# Altium project BOTTOM-REDUCED.PrjPcb
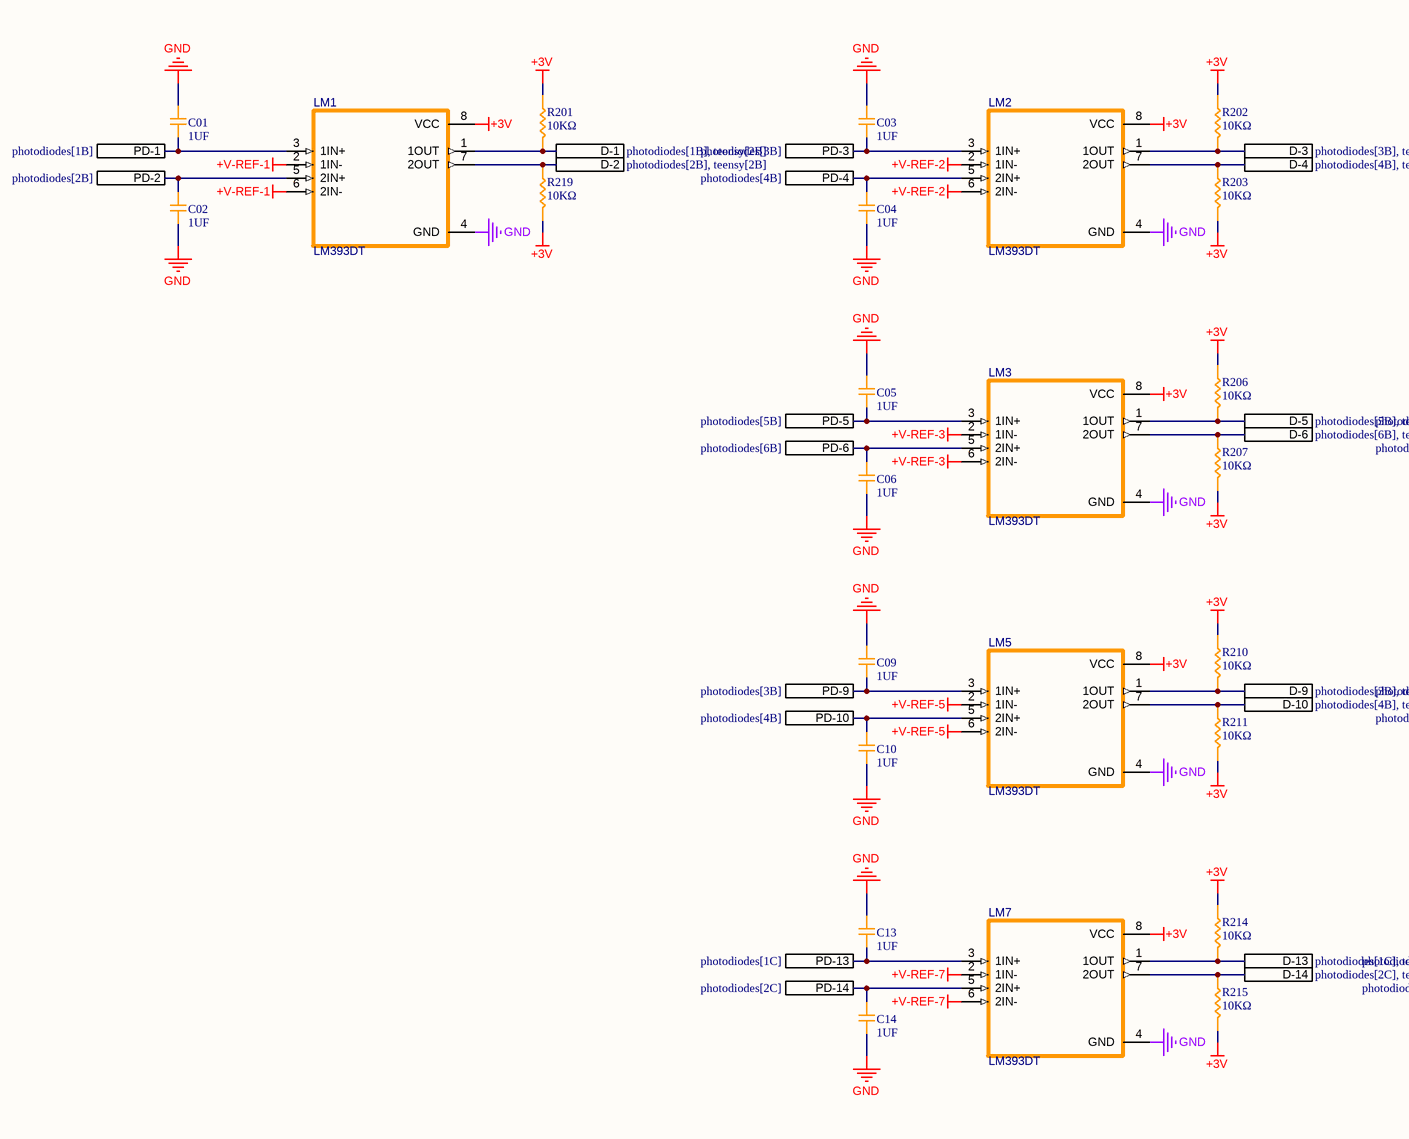
[diagram p0: comparators.SchDoc, left]
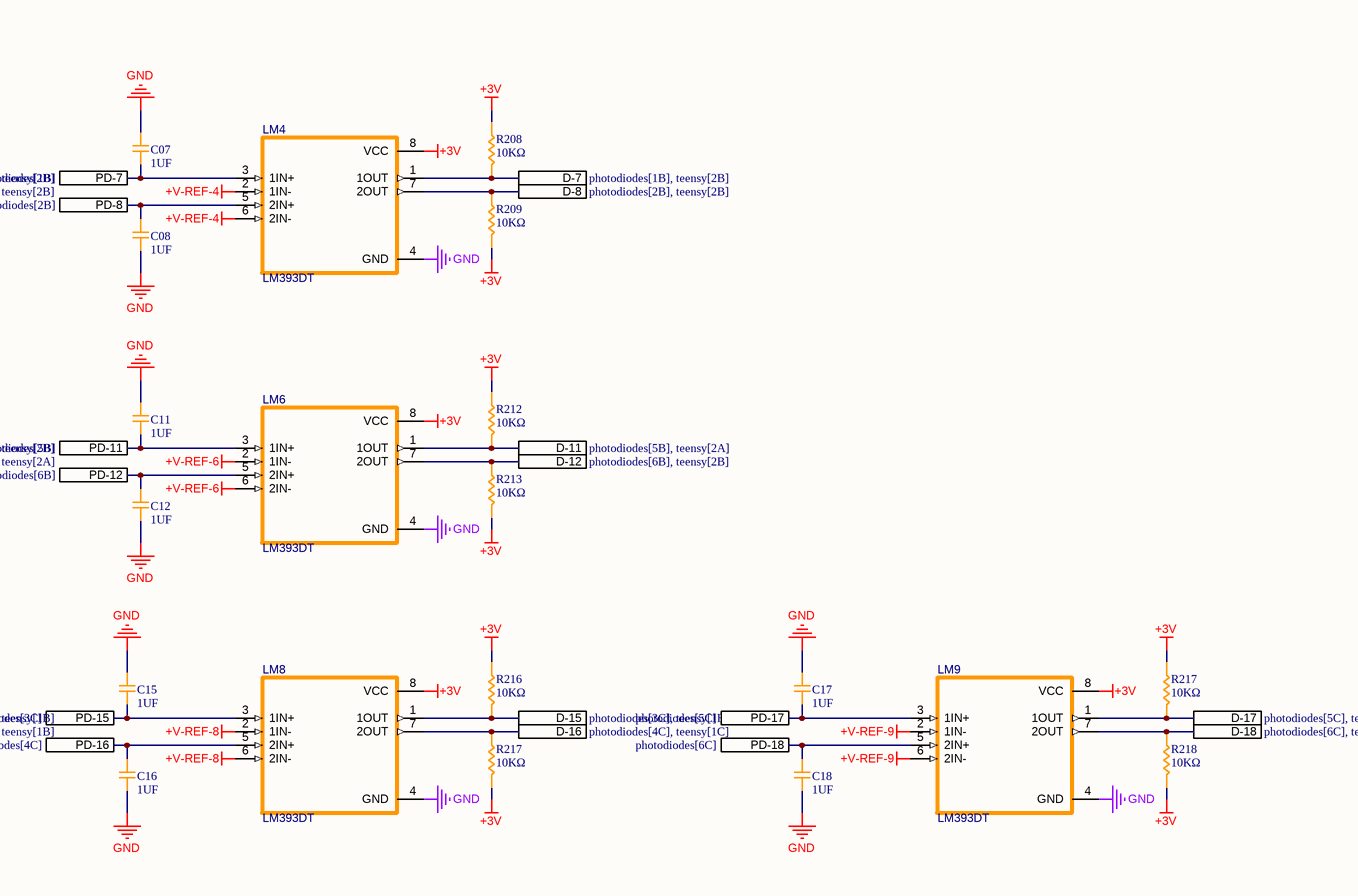
[diagram p1: comparators.SchDoc, right]
4 sheets, 137 parts. Net scope: flat (ports and power ports of the same name join across sheets).
Board file: BOTTOM-COMPARATOR.PcbDoc
Sheets:
  comparators.SchDoc
  neopixels.SchDoc
  photodiodes.SchDoc
  teensy.SchDoc

## Sheet comparators.SchDoc
size 508 x 241 mm; SheetNumber: 1; SheetTotal: 4

### Parts
(Parts that share a designator on the sheet are numbered #1, #2 ... from top to bottom, then left to right.)
C01  1UF  [CAP_0603]
C02  1UF  [CAP_0603]
C03  1UF  [CAP_0603]
C04  1UF  [CAP_0603]
C05  1UF  [CAP_0603]
C06  1UF  [CAP_0603]
C07  1UF  [CAP_0603]
C08  1UF  [CAP_0603]
C09  1UF  [CAP_0603]
C10  1UF  [CAP_0603]
C11  1UF  [CAP_0603]
C12  1UF  [CAP_0603]
C13  1UF  [CAP_0603]
C14  1UF  [CAP_0603]
C15  1UF  [CAP_0603]
C16  1UF  [CAP_0603]
C17  1UF  [CAP_0603]
C18  1UF  [CAP_0603]
LM1  LM393DT  [LM393DT]
LM2  LM393DT  [LM393DT]
LM3  LM393DT  [LM393DT]
LM4  LM393DT  [LM393DT]
LM5  LM393DT  [LM393DT]
LM6  LM393DT  [LM393DT]
LM7  LM393DT  [LM393DT]
LM8  LM393DT  [LM393DT]
LM9  LM393DT  [LM393DT]
R201  10KΩ  [RES_0603]
R202  10KΩ  [RES_0603]
R203  10KΩ  [RES_0603]
R206  10KΩ  [RES_0603]
R207  10KΩ  [RES_0603]
R208  10KΩ  [RES_0603]
R209  10KΩ  [RES_0603]
R210  10KΩ  [RES_0603]
R211  10KΩ  [RES_0603]
R212  10KΩ  [RES_0603]
R213  10KΩ  [RES_0603]
R214  10KΩ  [RES_0603]
R215  10KΩ  [RES_0603]
R216  10KΩ  [RES_0603]
R217#1  10KΩ  [RES_0603]
R217#2  10KΩ  [RES_0603]
R218  10KΩ  [RES_0603]
R219  10KΩ  [RES_0603]

### Ports
D-1 (see photodiodes[1B], teensy[2B]), D-2 (see photodiodes[2B], teensy[2B]), D-3 (see photodiodes[3B], teensy[2B]), D-4 (see photodiodes[4B], teensy[2B]), D-5 (see photodiodes[5B], teensy[2B]), D-6 (see photodiodes[6B], teensy[2B]), D-7 (see photodiodes[1B], teensy[2B]), D-8 (see photodiodes[2B], teensy[2B]), D-9 (see photodiodes[3B], teensy[2B]), D-10 (see photodiodes[4B], teensy[2A]), D-11 (see photodiodes[5B], teensy[2A]), D-12 (see photodiodes[6B], teensy[2B]), D-13 (see photodiodes[1C], teensy[1B]), D-14 (see photodiodes[2C], teensy[1B]), D-15 (see photodiodes[3C], teensy[1B]), D-16 (see photodiodes[4C], teensy[1C]), D-17 (see photodiodes[5C], teensy[2B]), D-18 (see photodiodes[6C], teensy[2C]), PD-1 (see photodiodes[1B]), PD-2 (see photodiodes[2B]), PD-3 (see photodiodes[3B]), PD-4 (see photodiodes[4B]), PD-5 (see photodiodes[5B]), PD-6 (see photodiodes[6B]), PD-7 (see photodiodes[1B]), PD-8 (see photodiodes[2B]), PD-9 (see photodiodes[3B]), PD-10 (see photodiodes[4B]), PD-11 (see photodiodes[5B]), PD-12 (see photodiodes[6B]), PD-13 (see photodiodes[1C]), PD-14 (see photodiodes[2C]), PD-15 (see photodiodes[3C]), PD-16 (see photodiodes[4C]), PD-17 (see photodiodes[5C]), PD-18 (see photodiodes[6C])

### Nets
+3V: LM1.8(VCC) LM2.8(VCC) LM3.8(VCC) LM4.8(VCC) LM5.8(VCC) LM6.8(VCC) LM7.8(VCC) LM8.8(VCC) LM9.8(VCC) R201.2 R202.2 R203.1 R206.2 R207.1 R208.2 R209.1 R210.2 R211.1 R212.2 R213.1 R214.2 R215.1 R216.2 R217#1.2 R217#2.1 R218.1 R219.1
+V-REF-1: LM1.2(1IN-) LM1.6(2IN-)
+V-REF-2: LM2.2(1IN-) LM2.6(2IN-)
+V-REF-3: LM3.2(1IN-) LM3.6(2IN-)
+V-REF-4: LM4.2(1IN-) LM4.6(2IN-)
+V-REF-5: LM5.2(1IN-) LM5.6(2IN-)
+V-REF-6: LM6.2(1IN-) LM6.6(2IN-)
+V-REF-7: LM7.2(1IN-) LM7.6(2IN-)
+V-REF-8: LM8.2(1IN-) LM8.6(2IN-)
+V-REF-9: LM9.2(1IN-) LM9.6(2IN-)
GND: C01.1 C02.2 C03.1 C04.1 C05.1 C06.2 C07.1 C08.2 C09.1 C10.2 C11.1 C12.2 C13.1 C14.2 C15.1 C16.2 C17.1 C18.2 LM1.4(GND) LM2.4(GND) LM3.4(GND) LM4.4(GND) LM5.4(GND) LM6.4(GND) LM7.4(GND) LM8.4(GND) LM9.4(GND)
NetC01_2: C01.2 LM1.3(1IN+) ; port PD-1
NetC02_1: C02.1 LM1.5(2IN+) ; port PD-2
NetC03_2: C03.2 LM2.3(1IN+) ; port PD-3
NetC04_2: C04.2 LM2.5(2IN+) ; port PD-4
NetC05_2: C05.2 LM3.3(1IN+) ; port PD-5
NetC06_1: C06.1 LM3.5(2IN+) ; port PD-6
NetC07_2: C07.2 LM4.3(1IN+) ; port PD-7
NetC08_1: C08.1 LM4.5(2IN+) ; port PD-8
NetC09_2: C09.2 LM5.3(1IN+) ; port PD-9
NetC10_1: C10.1 LM5.5(2IN+) ; port PD-10
NetC11_2: C11.2 LM6.3(1IN+) ; port PD-11
NetC12_1: C12.1 LM6.5(2IN+) ; port PD-12
NetC13_2: C13.2 LM7.3(1IN+) ; port PD-13
NetC14_1: C14.1 LM7.5(2IN+) ; port PD-14
NetC15_2: C15.2 LM8.3(1IN+) ; port PD-15
NetC16_1: C16.1 LM8.5(2IN+) ; port PD-16
NetC17_2: C17.2 LM9.3(1IN+) ; port PD-17
NetC18_1: C18.1 LM9.5(2IN+) ; port PD-18
NetLM1_1: LM1.1(1OUT) R201.1 ; port D-1
NetLM1_7: LM1.7(2OUT) R219.2 ; port D-2
NetLM2_1: LM2.1(1OUT) R202.1 ; port D-3
NetLM2_7: LM2.7(2OUT) R203.2 ; port D-4
NetLM3_1: LM3.1(1OUT) R206.1 ; port D-5
NetLM3_7: LM3.7(2OUT) R207.2 ; port D-6
NetLM4_1: LM4.1(1OUT) R208.1 ; port D-7
NetLM4_7: LM4.7(2OUT) R209.2 ; port D-8
NetLM5_1: LM5.1(1OUT) R210.1 ; port D-9
NetLM5_7: LM5.7(2OUT) R211.2 ; port D-10
NetLM6_1: LM6.1(1OUT) R212.1 ; port D-11
NetLM6_7: LM6.7(2OUT) R213.2 ; port D-12
NetLM7_1: LM7.1(1OUT) R214.1 ; port D-13
NetLM7_7: LM7.7(2OUT) R215.2 ; port D-14
NetLM8_1: LM8.1(1OUT) R216.1 ; port D-15
NetLM8_7: LM8.7(2OUT) R217#2.2 ; port D-16
NetLM9_1: LM9.1(1OUT) R217#1.1 ; port D-17
NetLM9_7: LM9.7(2OUT) R218.2 ; port D-18

### Library data of the parts
C01 C02 C03 C04 C05 C06 C07 C08 C09-C18 = CAP_0603: Capacitor SMD 0603 generic
R201-R203 R206-R216 R217#1 R217#2 R218 R219 = RES_0603: Resistor SMD 0603 generic

## Sheet neopixels.SchDoc
size 558 x 203 mm; SheetNumber: 2; SheetTotal: 3
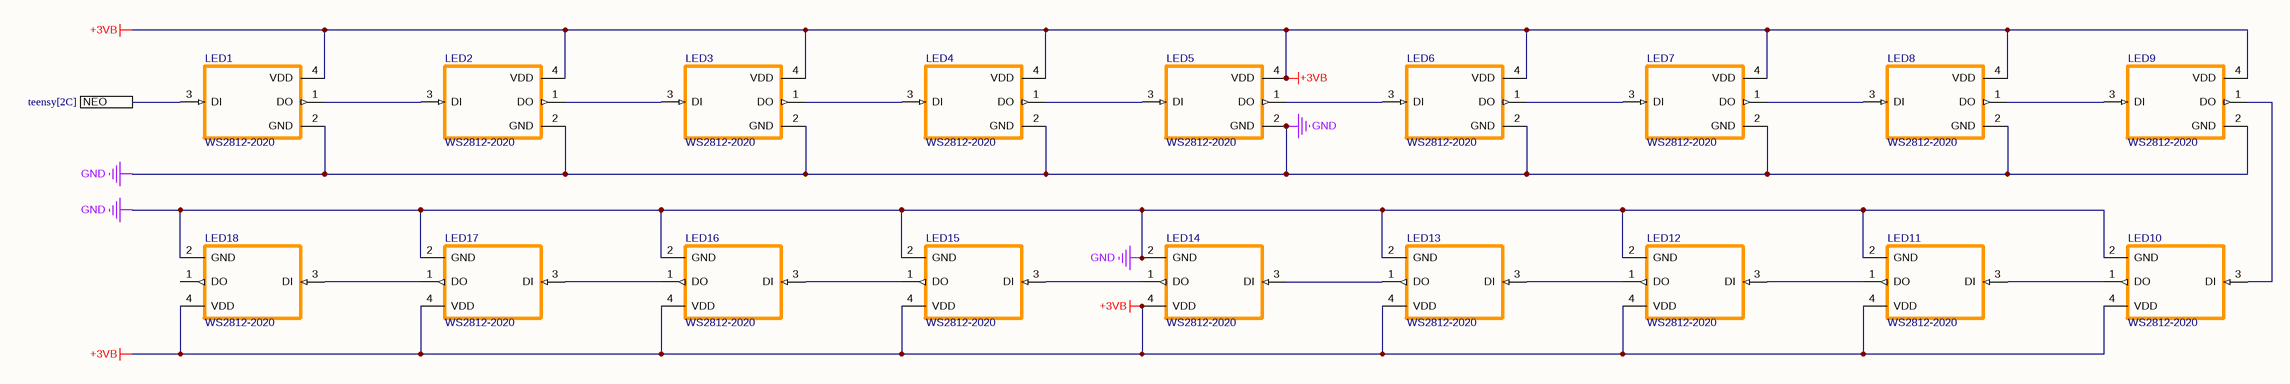
[diagram p2: neopixels.SchDoc]

### Parts
LED1  WS2812-2020  [WS2812-2020]
LED2  WS2812-2020  [WS2812-2020]
LED3  WS2812-2020  [WS2812-2020]
LED4  WS2812-2020  [WS2812-2020]
LED5  WS2812-2020  [WS2812-2020]
LED6  WS2812-2020  [WS2812-2020]
LED7  WS2812-2020  [WS2812-2020]
LED8  WS2812-2020  [WS2812-2020]
LED9  WS2812-2020  [WS2812-2020]
LED10  WS2812-2020  [WS2812-2020]
LED11  WS2812-2020  [WS2812-2020]
LED12  WS2812-2020  [WS2812-2020]
LED13  WS2812-2020  [WS2812-2020]
LED14  WS2812-2020  [WS2812-2020]
LED15  WS2812-2020  [WS2812-2020]
LED16  WS2812-2020  [WS2812-2020]
LED17  WS2812-2020  [WS2812-2020]
LED18  WS2812-2020  [WS2812-2020]

### Ports
NEO (see teensy[2C])

### Nets
+3VB: LED1.4(VDD) LED2.4(VDD) LED3.4(VDD) LED4.4(VDD) LED5.4(VDD) LED6.4(VDD) LED7.4(VDD) LED8.4(VDD) LED9.4(VDD) LED10.4(VDD) LED11.4(VDD) LED12.4(VDD) LED13.4(VDD) LED14.4(VDD) LED15.4(VDD) LED16.4(VDD) LED17.4(VDD) LED18.4(VDD)
GND: LED1.2(GND) LED2.2(GND) LED3.2(GND) LED4.2(GND) LED5.2(GND) LED6.2(GND) LED7.2(GND) LED8.2(GND) LED9.2(GND) LED10.2(GND) LED11.2(GND) LED12.2(GND) LED13.2(GND) LED14.2(GND) LED15.2(GND) LED16.2(GND) LED17.2(GND) LED18.2(GND)
NetLED1_1: LED1.1(DO) LED2.3(DI)
NetLED1_3: LED1.3(DI) ; port NEO
NetLED2_1: LED2.1(DO) LED3.3(DI)
NetLED3_1: LED3.1(DO) LED4.3(DI)
NetLED4_1: LED4.1(DO) LED5.3(DI)
NetLED5_1: LED5.1(DO) LED6.3(DI)
NetLED6_1: LED6.1(DO) LED7.3(DI)
NetLED7_1: LED7.1(DO) LED8.3(DI)
NetLED8_1: LED8.1(DO) LED9.3(DI)
NetLED9_1: LED9.1(DO) LED10.3(DI)
NetLED10_1: LED10.1(DO) LED11.3(DI)
NetLED11_1: LED11.1(DO) LED12.3(DI)
NetLED12_1: LED12.1(DO) LED13.3(DI)
NetLED13_1: LED13.1(DO) LED14.3(DI)
NetLED14_1: LED14.1(DO) LED15.3(DI)
NetLED15_1: LED15.1(DO) LED16.3(DI)
NetLED16_1: LED16.1(DO) LED17.3(DI)
NetLED17_1: LED17.1(DO) LED18.3(DI)

Not connected (* = marked no-connect by the designer): LED18 1(DO)

## Sheet photodiodes.SchDoc
size 457 x 241 mm; SheetNumber: 3; SheetTotal: 4
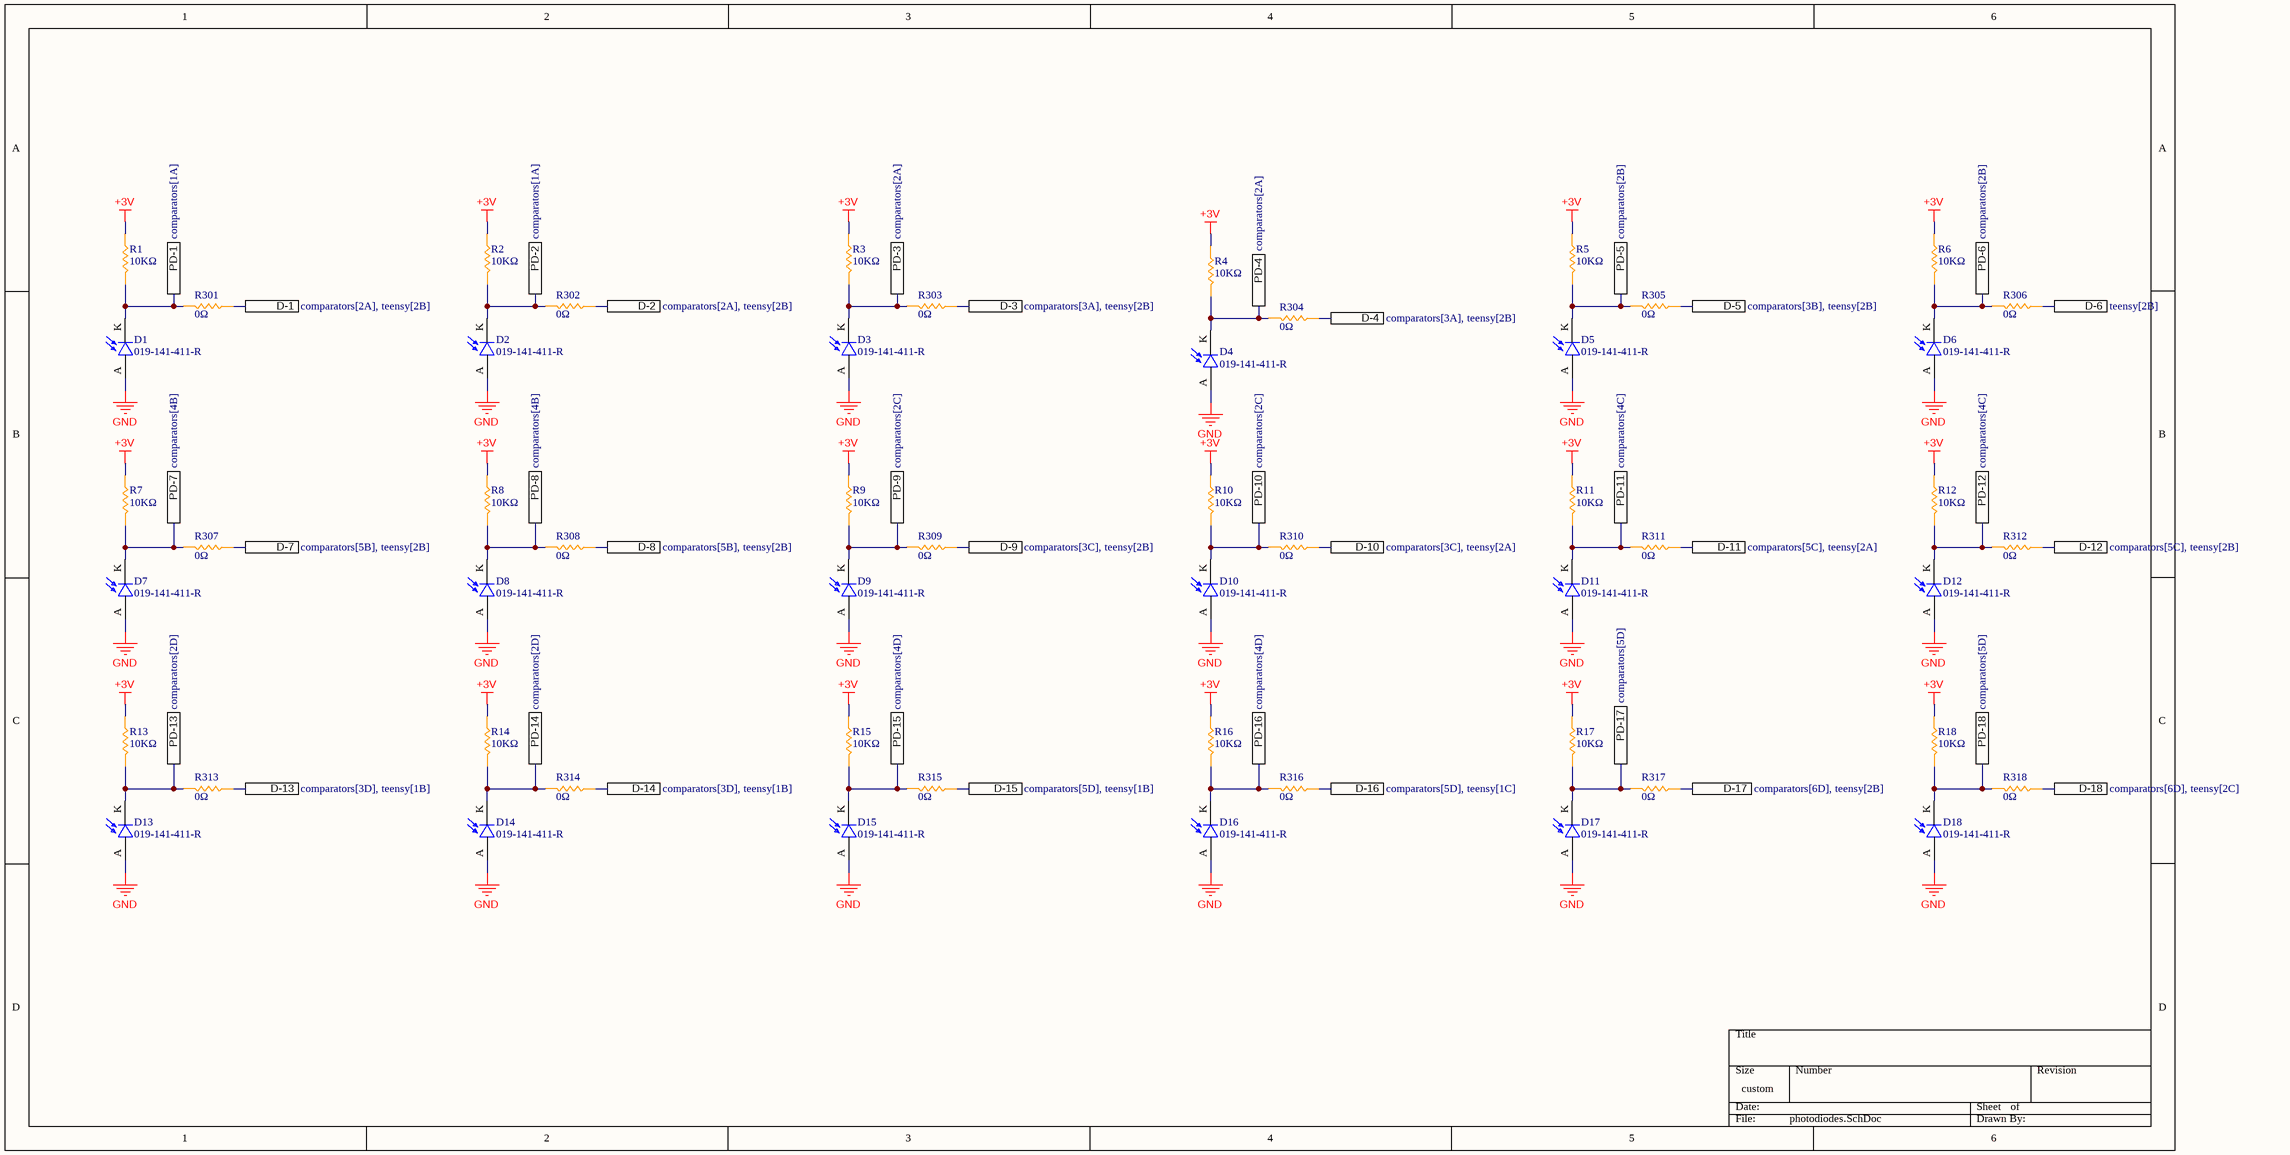
[diagram p3: photodiodes.SchDoc]

### Parts
D1  019-141-411-R  [DIOC2012X80N]
D2  019-141-411-R  [DIOC2012X80N]
D3  019-141-411-R  [DIOC2012X80N]
D4  019-141-411-R  [DIOC2012X80N]
D5  019-141-411-R  [DIOC2012X80N]
D6  019-141-411-R  [DIOC2012X80N]
D7  019-141-411-R  [DIOC2012X80N]
D8  019-141-411-R  [DIOC2012X80N]
D9  019-141-411-R  [DIOC2012X80N]
D10  019-141-411-R  [DIOC2012X80N]
D11  019-141-411-R  [DIOC2012X80N]
D12  019-141-411-R  [DIOC2012X80N]
D13  019-141-411-R  [DIOC2012X80N]
D14  019-141-411-R  [DIOC2012X80N]
D15  019-141-411-R  [DIOC2012X80N]
D16  019-141-411-R  [DIOC2012X80N]
D17  019-141-411-R  [DIOC2012X80N]
D18  019-141-411-R  [DIOC2012X80N]
R1  10KΩ  [RES_0603]
R2  10KΩ  [RES_0603]
R3  10KΩ  [RES_0603]
R4  10KΩ  [RES_0603]
R5  10KΩ  [RES_0603]
R6  10KΩ  [RES_0603]
R7  10KΩ  [RES_0603]
R8  10KΩ  [RES_0603]
R9  10KΩ  [RES_0603]
R10  10KΩ  [RES_0603]
R11  10KΩ  [RES_0603]
R12  10KΩ  [RES_0603]
R13  10KΩ  [RES_0603]
R14  10KΩ  [RES_0603]
R15  10KΩ  [RES_0603]
R16  10KΩ  [RES_0603]
R17  10KΩ  [RES_0603]
R18  10KΩ  [RES_0603]
R301  0Ω  [RES_0603]
R302  0Ω  [RES_0603]
R303  0Ω  [RES_0603]
R304  0Ω  [RES_0603]
R305  0Ω  [RES_0603]
R306  0Ω  [RES_0603]
R307  0Ω  [RES_0603]
R308  0Ω  [RES_0603]
R309  0Ω  [RES_0603]
R310  0Ω  [RES_0603]
R311  0Ω  [RES_0603]
R312  0Ω  [RES_0603]
R313  0Ω  [RES_0603]
R314  0Ω  [RES_0603]
R315  0Ω  [RES_0603]
R316  0Ω  [RES_0603]
R317  0Ω  [RES_0603]
R318  0Ω  [RES_0603]

### Ports
D-1 (see comparators[2A], teensy[2B]), D-2 (see comparators[2A], teensy[2B]), D-3 (see comparators[3A], teensy[2B]), D-4 (see comparators[3A], teensy[2B]), D-5 (see comparators[3B], teensy[2B]), D-6 (see teensy[2B]), D-7 (see comparators[5B], teensy[2B]), D-8 (see comparators[5B], teensy[2B]), D-9 (see comparators[3C], teensy[2B]), D-10 (see comparators[3C], teensy[2A]), D-11 (see comparators[5C], teensy[2A]), D-12 (see comparators[5C], teensy[2B]), D-13 (see comparators[3D], teensy[1B]), D-14 (see comparators[3D], teensy[1B]), D-15 (see comparators[5D], teensy[1B]), D-16 (see comparators[5D], teensy[1C]), D-17 (see comparators[6D], teensy[2B]), D-18 (see comparators[6D], teensy[2C]), PD-1 (see comparators[1A]), PD-2 (see comparators[1A]), PD-3 (see comparators[2A]), PD-4 (see comparators[2A]), PD-5 (see comparators[2B]), PD-6 (see comparators[2B]), PD-7 (see comparators[4B]), PD-8 (see comparators[4B]), PD-9 (see comparators[2C]), PD-10 (see comparators[2C]), PD-11 (see comparators[4C]), PD-12 (see comparators[4C]), PD-13 (see comparators[2D]), PD-14 (see comparators[2D]), PD-15 (see comparators[4D]), PD-16 (see comparators[4D]), PD-17 (see comparators[5D]), PD-18 (see comparators[5D])

### Nets
+3V: R1.2 R2.2 R3.2 R4.2 R5.2 R6.2 R7.2 R8.2 R9.2 R10.2 R11.2 R12.2 R13.2 R14.2 R15.2 R16.2 R17.2 R18.2
GND: D1.A D2.A D3.A D4.A D5.A D6.A D7.A D8.A D9.A D10.A D11.A D12.A D13.A D14.A D15.A D16.A D17.A D18.A
NetC01_2: D1.K(C) R1.1 R301.1 ; port PD-1
NetC02_1: D2.K(C) R2.1 R302.1 ; port PD-2
NetC03_2: D3.K(C) R3.1 R303.1 ; port PD-3
NetC04_2: D4.K(C) R4.1 R304.1 ; port PD-4
NetC05_2: D5.K(C) R5.1 R305.1 ; port PD-5
NetC06_1: D6.K(C) R6.1 R306.1 ; port PD-6
NetC07_2: D7.K(C) R7.1 R307.1 ; port PD-7
NetC08_1: D8.K(C) R8.1 R308.1 ; port PD-8
NetC09_2: D9.K(C) R9.1 R309.1 ; port PD-9
NetC10_1: D10.K(C) R10.1 R310.1 ; port PD-10
NetC11_2: D11.K(C) R11.1 R311.1 ; port PD-11
NetC12_1: D12.K(C) R12.1 R312.1 ; port PD-12
NetC13_2: D13.K(C) R13.1 R313.1 ; port PD-13
NetC14_1: D14.K(C) R14.1 R314.1 ; port PD-14
NetC15_2: D15.K(C) R15.1 R315.1 ; port PD-15
NetC16_1: D16.K(C) R16.1 R316.1 ; port PD-16
NetC17_2: D17.K(C) R17.1 R317.1 ; port PD-17
NetC18_1: D18.K(C) R18.1 R318.1 ; port PD-18
NetLM1_1: R301.2 ; port D-1
NetLM1_7: R302.2 ; port D-2
NetLM2_1: R303.2 ; port D-3
NetLM2_7: R304.2 ; port D-4
NetLM3_1: R305.2 ; port D-5
NetLM3_7: R306.2 ; port D-6
NetLM4_1: R307.2 ; port D-7
NetLM4_7: R308.2 ; port D-8
NetLM5_1: R309.2 ; port D-9
NetLM5_7: R310.2 ; port D-10
NetLM6_1: R311.2 ; port D-11
NetLM6_7: R312.2 ; port D-12
NetLM7_1: R313.2 ; port D-13
NetLM7_7: R314.2 ; port D-14
NetLM8_1: R315.2 ; port D-15
NetLM8_7: R316.2 ; port D-16
NetLM9_1: R317.2 ; port D-17
NetLM9_7: R318.2 ; port D-18

### Library data of the parts
D1-D18 = 019-141-411-R: PHOTODIODE RED MICRO SMT; MF: Advanced Photonix; Price: None; Check_prices: https://www.snapeda.com/parts/019-141-411-R/Advanced%20Photonix/view-part/5167997/?ref=eda; Value: *; Purchase-URL: https://pricing.snapeda.com/search/part/019-141-411-R/?ref=eda; Package: None; SnapEDA_Link: https://www.snapeda.com/parts/019-141-411-R/Advanced%20Photonix/view-part/5167997/?ref=snap; MP: 019-141-411-R; Availability: Warning
R1-R18 R301-R318 = RES_0603: Resistor SMD 0603 generic

## Sheet teensy.SchDoc
size A; SheetNumber: 4; SheetTotal: 4
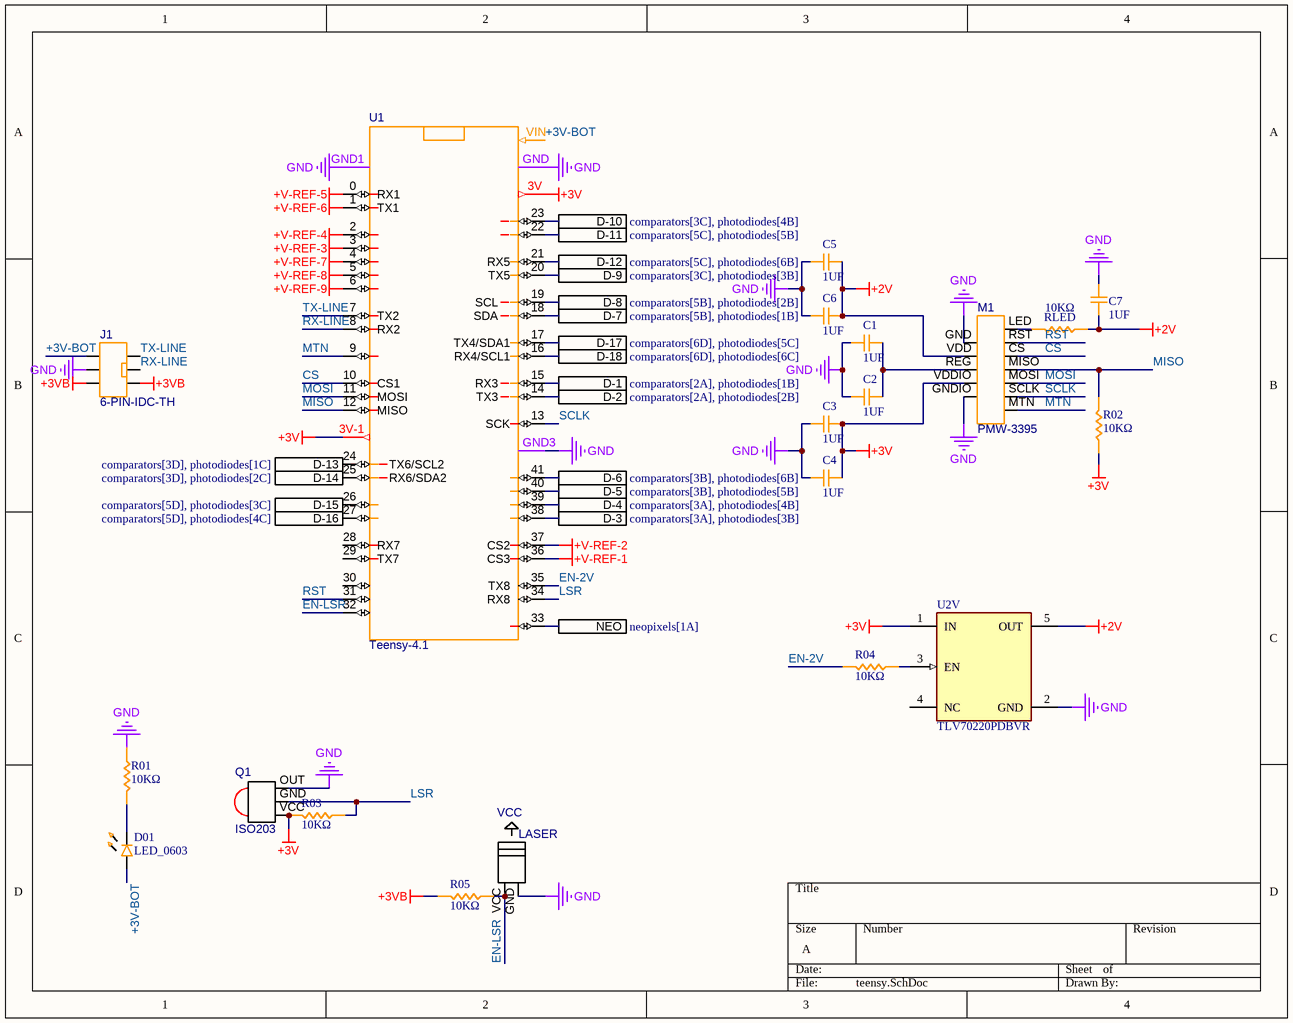
[diagram p4: teensy.SchDoc]

### Parts
C1  1UF  [CAP_0603]
C2  1UF  [CAP_0603]
C3  1UF  [CAP_0603]
C4  1UF  [CAP_0603]
C5  1UF  [CAP_0603]
C6  1UF  [CAP_0603]
C7  1UF  [CAP_0603]
D01  LED_0603  [LED_0603]
J1  6-PIN-IDC-TH  [6-PIN-IDC-TH]
M1  PMW-3395  [MOUSE-DIP16]
Q1  ISO203  [TSSP-58038]
R01  10KΩ  [RES_0603]
R02  10KΩ  [RES_0603]
R03  10KΩ  [RES_0603]
R04  10KΩ  [RES_0603]
R05  10KΩ  [RES_0603]
RLED  10KΩ  [RES_0603]
U1  Teensy-4.1  [Teensy-4.1]
U2V  TLV70220PDBVR  [FP-DBV0005A-MFG]
VCC  LASER  [LASER]

### Ports
D-1 (see comparators[2A], photodiodes[1B]), D-2 (see comparators[2A], photodiodes[2B]), D-3 (see comparators[3A], photodiodes[3B]), D-4 (see comparators[3A], photodiodes[4B]), D-5 (see comparators[3B], photodiodes[5B]), D-6 (see comparators[3B], photodiodes[6B]), D-7 (see comparators[5B], photodiodes[1B]), D-8 (see comparators[5B], photodiodes[2B]), D-9 (see comparators[3C], photodiodes[3B]), D-10 (see comparators[3C], photodiodes[4B]), D-11 (see comparators[5C], photodiodes[5B]), D-12 (see comparators[5C], photodiodes[6B]), D-13 (see comparators[3D], photodiodes[1C]), D-14 (see comparators[3D], photodiodes[2C]), D-15 (see comparators[5D], photodiodes[3C]), D-16 (see comparators[5D], photodiodes[4C]), D-17 (see comparators[6D], photodiodes[5C]), D-18 (see comparators[6D], photodiodes[6C]), NEO (see neopixels[1A])

### Nets
+2V: C5.1 C6.1 C7.1 M1.VDD RLED.2 U2V.5(OUT)
+3V: C3.2 C4.2 M1.VDDIO Q1.VCC R02.2 R03.1 U1.3V U1.3V-1 U2V.1(IN)
+3VB: J1.3 J1.4 R05.1
+V-REF-1: U1.36(CS3)
+V-REF-2: U1.37(CS2)
+V-REF-3: U1.3
+V-REF-4: U1.2
+V-REF-5: U1.0(RX1)
+V-REF-6: U1.1(TX1)
+V-REF-7: U1.4
+V-REF-8: U1.5
+V-REF-9: U1.6
GND: C1.1 C2.1 C3.1 C4.1 C5.2 C6.2 C7.2 J1.2 M1.GND M1.GNDIO Q1.OUT R01.2 U1.GND U1.GND1 U1.GND3 U2V.2(GND) VCC.GND
+3V-BOT: D01.A J1.1 U1.VIN
CS: M1.CS U1.10(CS1)
EN-2V: R04.1 U1.35(TX8)
EN-LSR: R05.2 U1.32 VCC.VCC
LSR: Q1.GND R03.2 U1.34(RX8)
MISO: M1.MISO R02.1 U1.12(MISO)
MOSI: M1.MOSI U1.11(MOSI)
MTN: M1.MTN U1.9
RST: M1.RST U1.31
RX-LINE: J1.5 U1.8(RX2)
SCLK: M1.SCLK U1.13(SCK)
TX-LINE: J1.6 U1.7(TX2)
NetC1_2: C1.2 C2.2 M1.REG
NetD01_C: D01.C R01.1
NetLED1_3: U1.33 ; port NEO
NetLM1_1: U1.15(RX3) ; port D-1
NetLM1_7: U1.14(TX3) ; port D-2
NetLM2_1: U1.38 ; port D-3
NetLM2_7: U1.39 ; port D-4
NetLM3_1: U1.40 ; port D-5
NetLM3_7: U1.41 ; port D-6
NetLM4_1: U1.18(SDA) ; port D-7
NetLM4_7: U1.19(SCL) ; port D-8
NetLM5_1: U1.20(TX5) ; port D-9
NetLM5_7: U1.23 ; port D-10
NetLM6_1: U1.22 ; port D-11
NetLM6_7: U1.21(RX5) ; port D-12
NetLM7_1: U1.24(TX6/SCL2) ; port D-13
NetLM7_7: U1.25(RX6/SDA2) ; port D-14
NetLM8_1: U1.26 ; port D-15
NetLM8_7: U1.27 ; port D-16
NetLM9_1: U1.17(TX4/SDA1) ; port D-17
NetLM9_7: U1.16(RX4/SCL1) ; port D-18
NetM1_LED: M1.LED RLED.1
NetR04_2: R04.2 U2V.3(EN)

Not connected (* = marked no-connect by the designer): U1 28(RX7) 29(TX7) 30; U2V 4(NC)

### Library data of the parts
C1-C7 = CAP_0603: Capacitor SMD 0603 generic
Q1 = TSSP-58038
R01 R02 R03 R04 R05 RLED = RES_0603: Resistor SMD 0603 generic
U2V = CMP-0394-00506-3: IC REG LINEAR 2V 300MA SOT23-5; Manufacturer: Texas Instruments; Number Of Outputs: 1; Max Junction Temp: +125°C; Max Supply Voltage: 5.5V; Ciiva Ids: 1503676; Standoff Height: 0mm; Dropout Voltage: 260mV; Output Type: Fixed; Accuracy Percentage: 0.5%; Import Ts: 1521850062; Output Voltage: 2V; Temperature Range High: +125°C; Lead Free: Yes; Digikey Description: IC REG LINEAR 2V 300MA SOT23-5; Release Date: 1464578725; Manufacturer Part Number: TLV70220PDBVR; Category: IC; Octopart: https://octopart.com/tlv70220pdbvr-texas+instruments-20023687; RoHS: TRUE; Automotive: No; Output Current: 300mA; ComponentLink2Description: Datasheet; Device Class L3: Voltage Regulators - Linear; ComponentLink2URL: http://www.ti.com/lit/ds/symlink/tlv702p.pdf; Mouser Description: LDO Voltage Regulators 300mA,Low IQ,LDO Reg; Package: DBV0005A; Height: 1.45mm; Min Supply Voltage: 2V; Device Class L2: Power Management ICs; Device Class L1: Integrated Circuits (ICs); Temperature: -40°C to +125°C; Temperature Range Low: -40°C

## Nets that join several sheets
+3V: comparators (27 pins), photodiodes (18 pins), teensy (9 pins)
+3VB: neopixels (18 pins), teensy (J1.3 J1.4 R05.1)
+V-REF-1: comparators (LM1.2 LM1.6), teensy (U1.36)
+V-REF-2: comparators (LM2.2 LM2.6), teensy (U1.37)
+V-REF-3: comparators (LM3.2 LM3.6), teensy (U1.3)
+V-REF-4: comparators (LM4.2 LM4.6), teensy (U1.2)
+V-REF-5: comparators (LM5.2 LM5.6), teensy (U1.0)
+V-REF-6: comparators (LM6.2 LM6.6), teensy (U1.1)
+V-REF-7: comparators (LM7.2 LM7.6), teensy (U1.4)
+V-REF-8: comparators (LM8.2 LM8.6), teensy (U1.5)
+V-REF-9: comparators (LM9.2 LM9.6), teensy (U1.6)
GND: comparators (27 pins), neopixels (18 pins), photodiodes (18 pins), teensy (17 pins)
NetC01_2: comparators (C01.2 LM1.3), photodiodes (D1.K R1.1 R301.1)
NetC02_1: comparators (C02.1 LM1.5), photodiodes (D2.K R2.1 R302.1)
NetC03_2: comparators (C03.2 LM2.3), photodiodes (D3.K R3.1 R303.1)
NetC04_2: comparators (C04.2 LM2.5), photodiodes (D4.K R4.1 R304.1)
NetC05_2: comparators (C05.2 LM3.3), photodiodes (D5.K R5.1 R305.1)
NetC06_1: comparators (C06.1 LM3.5), photodiodes (D6.K R6.1 R306.1)
NetC07_2: comparators (C07.2 LM4.3), photodiodes (D7.K R7.1 R307.1)
NetC08_1: comparators (C08.1 LM4.5), photodiodes (D8.K R8.1 R308.1)
NetC09_2: comparators (C09.2 LM5.3), photodiodes (D9.K R9.1 R309.1)
NetC10_1: comparators (C10.1 LM5.5), photodiodes (D10.K R10.1 R310.1)
NetC11_2: comparators (C11.2 LM6.3), photodiodes (D11.K R11.1 R311.1)
NetC12_1: comparators (C12.1 LM6.5), photodiodes (D12.K R12.1 R312.1)
NetC13_2: comparators (C13.2 LM7.3), photodiodes (D13.K R13.1 R313.1)
NetC14_1: comparators (C14.1 LM7.5), photodiodes (D14.K R14.1 R314.1)
NetC15_2: comparators (C15.2 LM8.3), photodiodes (D15.K R15.1 R315.1)
NetC16_1: comparators (C16.1 LM8.5), photodiodes (D16.K R16.1 R316.1)
NetC17_2: comparators (C17.2 LM9.3), photodiodes (D17.K R17.1 R317.1)
NetC18_1: comparators (C18.1 LM9.5), photodiodes (D18.K R18.1 R318.1)
NetLED1_3: neopixels (LED1.3), teensy (U1.33)
NetLM1_1: comparators (LM1.1 R201.1), photodiodes (R301.2), teensy (U1.15)
NetLM1_7: comparators (LM1.7 R219.2), photodiodes (R302.2), teensy (U1.14)
NetLM2_1: comparators (LM2.1 R202.1), photodiodes (R303.2), teensy (U1.38)
NetLM2_7: comparators (LM2.7 R203.2), photodiodes (R304.2), teensy (U1.39)
NetLM3_1: comparators (LM3.1 R206.1), photodiodes (R305.2), teensy (U1.40)
NetLM3_7: comparators (LM3.7 R207.2), photodiodes (R306.2), teensy (U1.41)
NetLM4_1: comparators (LM4.1 R208.1), photodiodes (R307.2), teensy (U1.18)
NetLM4_7: comparators (LM4.7 R209.2), photodiodes (R308.2), teensy (U1.19)
NetLM5_1: comparators (LM5.1 R210.1), photodiodes (R309.2), teensy (U1.20)
NetLM5_7: comparators (LM5.7 R211.2), photodiodes (R310.2), teensy (U1.23)
NetLM6_1: comparators (LM6.1 R212.1), photodiodes (R311.2), teensy (U1.22)
NetLM6_7: comparators (LM6.7 R213.2), photodiodes (R312.2), teensy (U1.21)
NetLM7_1: comparators (LM7.1 R214.1), photodiodes (R313.2), teensy (U1.24)
NetLM7_7: comparators (LM7.7 R215.2), photodiodes (R314.2), teensy (U1.25)
NetLM8_1: comparators (LM8.1 R216.1), photodiodes (R315.2), teensy (U1.26)
NetLM8_7: comparators (LM8.7 R217#2.2), photodiodes (R316.2), teensy (U1.27)
NetLM9_1: comparators (LM9.1 R217#1.1), photodiodes (R317.2), teensy (U1.17)
NetLM9_7: comparators (LM9.7 R218.2), photodiodes (R318.2), teensy (U1.16)